# Altium project Rugzak.PrjPCB
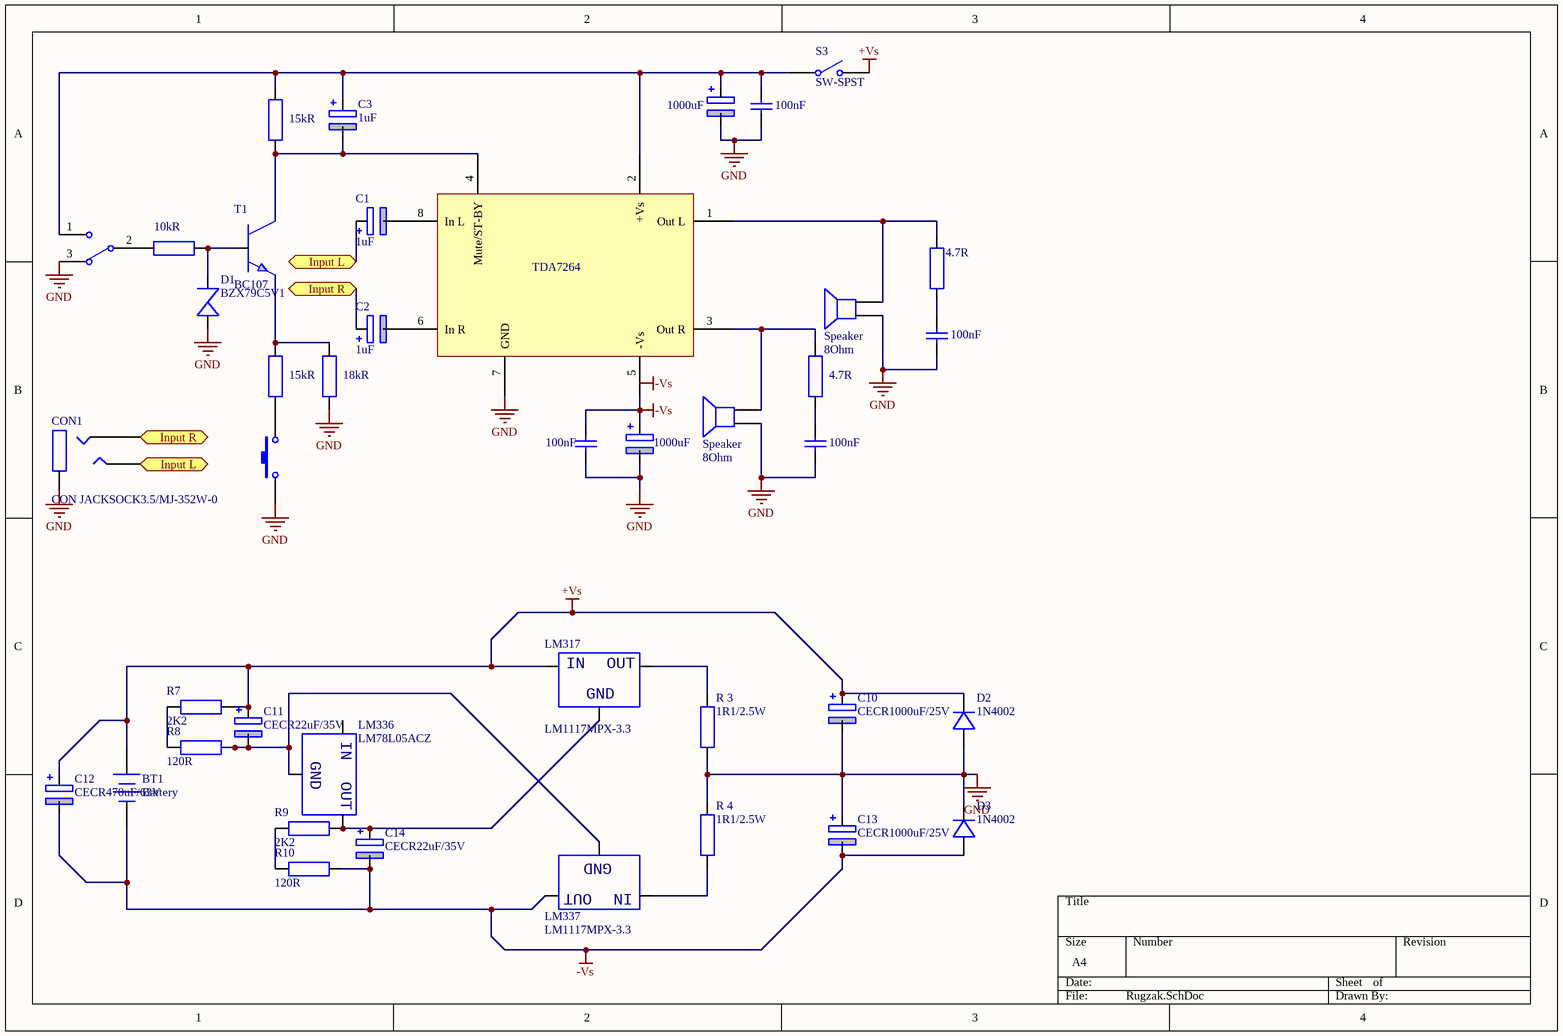
[diagram p0: Rugzak.SchDoc]
1 sheet, 41 parts. Net scope: flat (ports and power ports of the same name join across sheets).
Board file: Rugzak.PcbDoc

## Sheet Rugzak.SchDoc
size A4

### Parts
BT1  Battery  [BAT-2]
C1  1uF  [cap 83 pol (D.21/.08/60/28)]
C2  1uF  [cap 83 pol (D.21/.08/60/28)]
C3  1uF  [cap 83 pol (D.21/.08/60/28)]
C4  value 1000uF  [cap 48 pol (.46/.2/.6/125/36)]  (hidden comment: Cap)
C5  100nF  [RAD-0.3]
C6  value 1000uF  [cap 48 pol (.46/.2/.6/125/36)]  (hidden comment: Cap)
C7  value 100nF  [RAD-0.3]  (hidden comment: Cap)
C8  value 100nF  [RAD-0.3]  (hidden comment: Cap)
C9  value 100nF  [RAD-0.3]  (hidden comment: Cap)
C10  CECR1000uF/25V  [cap 64 pol (D.4/.2/80/36)]
C11  CECR22uF/35V  [cap 62 pol (D.22/.1/75/32)]
C12  CECR470uF/63V  [cap 63 pol (D.52/.2/90/36)]
C13  CECR1000uF/25V  [cap 64 pol (D.4/.2/80/36)]
C14  CECR22uF/35V  [cap 62 pol (D.22/.1/75/32)]
CON1  CON JACKSOCK3.5/MJ-352W-0  [con jacksock 3.5mm (MJ-352W-0)]
D1  BZX79C5V1  [DO-35]
D2  1N4002  [DO-41]
D3  1N4002  [DO-41]
LM317  LM1117MPX-3.3  [smd SOT-223]
LM336  LM78L05ACZ  [TO-92]
LM337  LM1117MPX-3.3  [smd SOT-223]
LS_L  Speaker  Internal Resistance: 8Ohm  [PIN2]
LS_R  Speaker  Internal Resistance: 8Ohm  [PIN2]
R1  value 10kR  [ws 0.6W H]  (hidden comment: Res)
R2  value 15kR  [ws 0.6W H]  (hidden comment: Res)
R3  value 18kR  [ws 0.6W H]  (hidden comment: Res)
R4  value 15kR  [ws 0.6W H]  (hidden comment: Res)
R5  value 4.7R  [ws 0.6W H]  (hidden comment: Res)
R6  value 4.7R  [ws 0.6W H]  (hidden comment: Res)
R7  2K2  [ws 0.6W H]
R8  120R  [ws 0.6W H]
R9  2K2  [ws 0.6W H]
R10  120R  [ws 0.6W H]
R_3  1R1/2.5W  [ws 2.5W H]
R_4  1R1/2.5W  [ws 2.5W H]
S1  SW-SPDT  [TL36WW15050]  (value not drawn)
S2  SW-PB  [SPST-2]  (value not drawn)
S3  SW-SPST  [SPST-2]
T1  BC107  [TO-18]
TDA7264  TDA7264 stereo audio amplifier  [MultiWatt8]  (value not drawn)

### Ports
Input L, Input R

### Nets
+Vs: BT1.1(+) C10.1 C11.1 C12.1 D2.2 LM317.3 R7.1 S3.2(NO)
-Vs: BT1.2(-) C6.1 C7.2 C12.2 C13.2 C14.2 D3.1 LM337.2 R10.1 TDA7264.5(-Vs)
GND: C4.2 C5.1 C6.2 C7.1 C8.1 C9.1 C10.2 C13.1 CON1.1 D1.1 D2.1 D3.2 LS_L.1 LS_R.1 R3.1 R_3.1 R_4.2 S1.3 S2.1 TDA7264.7(GND)
NetC1_1: C1.1 CON1.2 ; port Input L
NetC1_2: C1.2 TDA7264.8(In_L)
NetC2_1: C2.1 CON1.3 ; port Input R
NetC2_2: C2.2 TDA7264.6(In_R)
NetC3_1: C3.1 C4.1 C5.2 R2.2 S1.1 S3.1(COMMON) TDA7264.2(+Vs)
NetC3_2: C3.2 R2.1 T1.3 TDA7264.4(Mute/ST-BY)
NetC8_2: C8.2 R5.2
NetC9_2: C9.2 R6.1
NetC11_2: C11.2 LM336.2 LM337.1 R8.1
NetC14_1: C14.1 LM317.1 LM336.3 R9.1
NetD1_2: D1.2 R1.1 T1.2
NetLM317_2: LM317.2 R_3.2
NetLM337_3: LM337.3 R_4.1
NetLS_L_2: LS_L.2 R5.1 TDA7264.1(Out_L)
NetLS_R_2: LS_R.2 R6.2 TDA7264.3(Out_R)
NetR1_2: R1.2 S1.2
NetR3_2: R3.2 R4.2 T1.1
NetR4_1: R4.1 S2.2
NetR7_2: R7.2 R8.2
NetR9_2: R9.2 R10.2

Not connected (* = marked no-connect by the designer): LM336 1

### Notes on the sheet
- Labels drawn without touching a wire or pin: -Vs
- (in symbol LM78L05ACZ) IN; GND; OUT
- (in symbol LM1117MPX-3.3) GND; OUT; IN

### Library data of the parts
BT1 = Battery: Multicell Battery; Published: 24-Mar-1999; LatestRevisionDate: 17-Jul-2002; LatestRevisionNote: Re-released for DXP Platform.; PackageReference: BAT-2; Publisher: Altium Limited; PackageDescription: Battery; 2 Leads
C1-C3 = CECR22uF/16V: elektrolytische condensator radiaal 22uF/16V; Part Number: CECR22uF/16V; Component Kind: Standard; Component Type: Standard; Designator: CECR22uF/16V; Pin Count: 2
C4 C6 = CECA0.47uF/63V: elektrolytische condensator axiaal 0.47uF/63V; Part Number: CECA0.47uF/63V; Component Kind: Standard; Component Type: Standard; Designator: CECA0.47uF/63V; Pin Count: 2
C5 C7-C9 = Cap: Capacitor; Published: 8-Jun-2000; LatestRevisionDate: 17-Jul-2002; LatestRevisionNote: Re-released for DXP Platform.; PackageReference: RAD-0.3; Publisher: Altium Limited; PackageDescription: Radial Cap, Thru-Hole; 2 Leads; 0.3 in Pin Spacing
C10 C13 = CECR1000uF/25V: elektrolytische condensator radiaal 1000uF/25V
C11 C14 = CECR22uF/35V: elektrolytische condensator radiaal 22uF/35V; Part Number: CECR22uF/35V; Component Kind: Standard; Component Type: Standard; Designator: CECR22uF/35V; Pin Count: 2
C12 = CECR470uF/63V: elektrolytische condensator radiaal 470uF/63V; Part Number: CECR470uF/63V; Component Kind: Standard; Component Type: Standard; Designator: CECR470uF/63V; Pin Count: 2
CON1 = CON JACKSOCK3.5/MJ-352W-0: audio socket 3.5mm stereo, MJ-352W-0; Part Number: CON JACKSOCK3.5/MJ-352W-0; Component Kind: Standard; Component Type: Standard; Designator: CON JACKSOCK3.5/MJ-352W-0; Pin Count: 3
D1 = BZX79C5V1: zenerdiode 400mW/5V1; Part Number: BZX79C5V1; Component Kind: Standard; Component Type: Standard; Designator: BZX79C5V1; Pin Count: 2
D2 D3 = 1N4002: gelijkrichterdiode 100V/1A; Part Number: 1N4002; Component Kind: Standard; Component Type: Standard; Designator: 1N4002; Pin Count: 2
LM317 LM337 = LM1117MPX-3.3: low dropout linear regulator, 3.3V 800mA, SOT-223; Part Number: LM1117MPX-3.3; Component Kind: Standard; Component Type: Standard; Designator: LM1117MPX-3.3; Pin Count: 3
LM336 = LM78L05ACZ: spanningsregelaar, +5V, TO-92
LS_L LS_R = Speaker: Loudspeaker; Published: 24-Mar-1999; LatestRevisionDate: 17-Jul-2002; LatestRevisionNote: Re-released for DXP Platform.; PackageReference: PIN2; Publisher: Altium Limited
R1-R6 = 0R2: weerstand 0R2 0.6W
R7 R9 = 2K2: weerstand 2K2 0.6W
R8 R10 = 120R: weerstand 120R 0.6W
R_3 R_4 = 1R1/2.5W: weerstand 1R1 2.5W
S1 = SW-SPDT: SPDT Subminiature Toggle Switch, Right Angle Mounting, Vertical Actuation; Published: 24-Mar-1999; LatestRevisionDate: 17-Dec-2003; LatestRevisionNote: Schematic revised, PCB Footprint replaced.; DatasheetVersion: 05-Dec-2000; PackageReference: TL36WW15050; Publisher: Altium Limited; PackageDescription: Switch; 4 Leads; ComponentLink1Description: Manufacturer Link; ComponentLink1URL: http://www.apem.com
S2 = SW-PB: Switch; Published: 24-Mar-1999; LatestRevisionDate: 17-Jul-2002; LatestRevisionNote: Re-released for DXP Platform.; PackageReference: SPST-2; Publisher: Altium Limited; PackageDescription: Switch; 2 Leads
S3 = SW-SPST: Single-Pole, Single-Throw Switch; Published: 24-Mar-1999; LatestRevisionDate: 17-Jul-2002; LatestRevisionNote: Re-released for DXP Platform.; PackageReference: SPST-2; Publisher: Altium Limited; PackageDescription: Switch; 2 Leads
T1 = BC107: NPN transistor
TDA7264 = TDA7264 stereo audio amplifier: 25 W + 25 W stereo amplifier with mute and standby